# Altium schematic sheet mcu.schdoc: MCU
size A4; Date: 10.25.2025; CheckedBy: BCY; DrawnBy: miaow; DocumentNumber: 11; Revision: v1.0.0; SheetNumber: 11; SheetTotal: 14; BoardType: MAIN_PCB; Desc: MCB block diagram
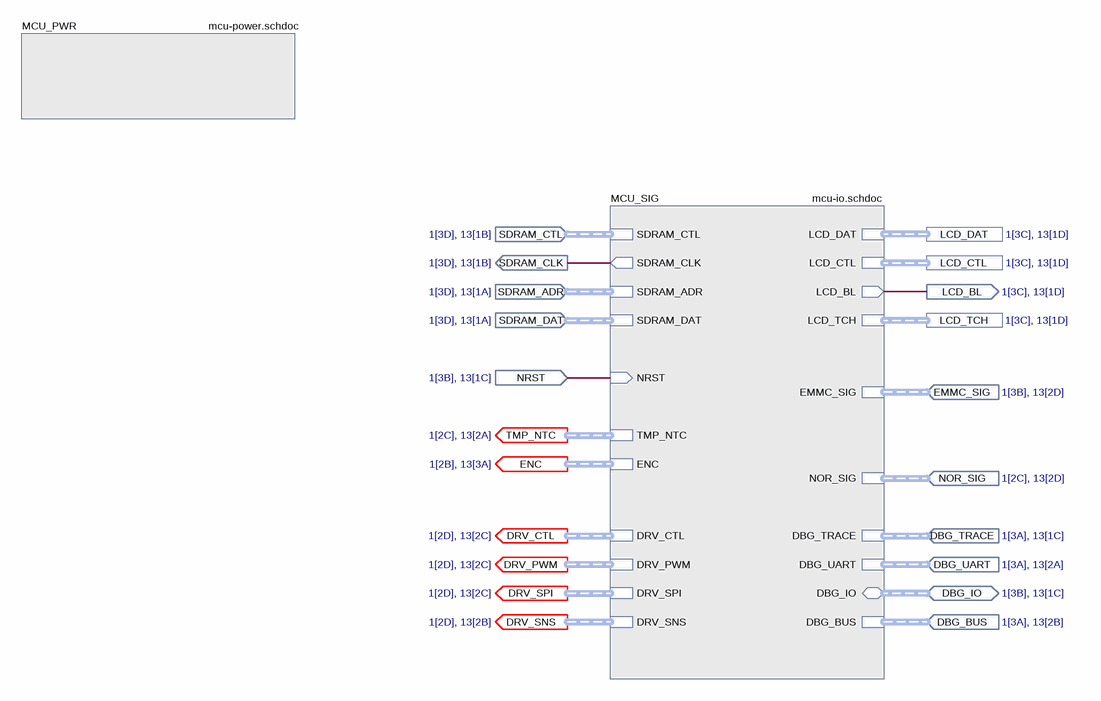
[diagram p0: mcu.schdoc]

## Sub-sheets
MCU_PWR = mcu-power.schdoc: no entries
MCU_SIG = mcu-io.schdoc: SDRAM_CTL (harness SDRAM_CTL), SDRAM_CLK (out), SDRAM_DAT (harness SDRAM_DAT), SDRAM_ADR (harness SDRAM_ADR), NRST (in), DRV_CTL (harness DRV_CTL), DRV_PWM (harness DRV_PWM), DRV_SPI (harness DRV_SPI), DRV_SNS (harness DRV_SNS), LCD_DAT (harness LCD_DAT), LCD_CTL (harness LCD_CTL), LCD_BL (out), LCD_TCH (harness LCD_TCH), EMMC_SIG (harness EMMC_SIG), NOR_SIG (harness NOR_SIG), DBG_TRACE (harness DBG_TRACE), DBG_UART (harness DBG_UART), DBG_IO (bidir, harness DBG_IO), DBG_BUS (harness DBG_BUS), TMP_NTC (harness TMP_NTC), ENC (harness ENC_SIG)

## Ports
DBG_BUS (in, harness DBG_BUS, see 1[3A], 13[2B]), DBG_IO (bidir, harness DBG_IO, see 1[3B], 13[1C]), DBG_TRACE (in, harness DBG_TRACE, see 1[3A], 13[1C]), DBG_UART (in, harness DBG_UART, see 1[3A], 13[2A]), DRV_CTL (out, harness DRV_CTL, see 1[2D], 13[2C]), DRV_PWM (out, harness DRV_PWM, see 1[2D], 13[2C]), DRV_SNS (out, harness DRV_SNS, see 1[2D], 13[2B]), DRV_SPI (out, harness DRV_SPI, see 1[2D], 13[2C]), EMMC_SIG (in, harness EMMC_SIG, see 1[3B], 13[2D]), ENC (out, harness ENC_SIG, see 1[2B], 13[3A]), LCD_BL (out, see 1[3C], 13[1D]), LCD_CTL (harness LCD_CTL, see 1[3C], 13[1D]), LCD_DAT (harness LCD_DAT, see 1[3C], 13[1D]), LCD_TCH (harness LCD_TCH, see 1[3C], 13[1D]), NOR_SIG (in, harness NOR_SIG, see 1[2C], 13[2D]), NRST (in, see 1[3B], 13[1C]), SDRAM_ADR (in, harness SDRAM_ADR, see 1[3D], 13[1A]), SDRAM_CLK (out, see 1[3D], 13[1B]), SDRAM_CTL (in, harness SDRAM_CTL, see 1[3D], 13[1B]), SDRAM_DAT (in, harness SDRAM_DAT, see 1[3D], 13[1A]), TMP_NTC (out, harness TMP_NTC, see 1[2C], 13[2A])

## Nets
LCD_BL: port LCD_BL, sheet MCU_SIG/LCD_BL
NRST: port NRST, sheet MCU_SIG/NRST
SDRAM_CLK: port SDRAM_CLK, sheet MCU_SIG/SDRAM_CLK

## Buses and harness runs
harness port DBG_BUS = sheet MCU_SIG/DBG_BUS
harness port DBG_IO = sheet MCU_SIG/DBG_IO
harness port DBG_TRACE = sheet MCU_SIG/DBG_TRACE
harness port DBG_UART = sheet MCU_SIG/DBG_UART
harness port DRV_CTL = sheet MCU_SIG/DRV_CTL
harness port DRV_PWM = sheet MCU_SIG/DRV_PWM
harness port DRV_SNS = sheet MCU_SIG/DRV_SNS
harness port DRV_SPI = sheet MCU_SIG/DRV_SPI
harness port EMMC_SIG = sheet MCU_SIG/EMMC_SIG
harness port ENC = sheet MCU_SIG/ENC
harness port LCD_CTL = sheet MCU_SIG/LCD_CTL
harness port LCD_DAT = sheet MCU_SIG/LCD_DAT
harness port LCD_TCH = sheet MCU_SIG/LCD_TCH
harness port NOR_SIG = sheet MCU_SIG/NOR_SIG
harness port SDRAM_ADR = sheet MCU_SIG/SDRAM_ADR
harness port SDRAM_CTL = sheet MCU_SIG/SDRAM_CTL
harness port SDRAM_DAT = sheet MCU_SIG/SDRAM_DAT
harness port TMP_NTC = sheet MCU_SIG/TMP_NTC

## Notes on the sheet
- DRAWN
- CHECKED
- DRAWNBY
- SHEETS
- SHEETS_NO